# Altium project MicroMultimeter.PrjPCB
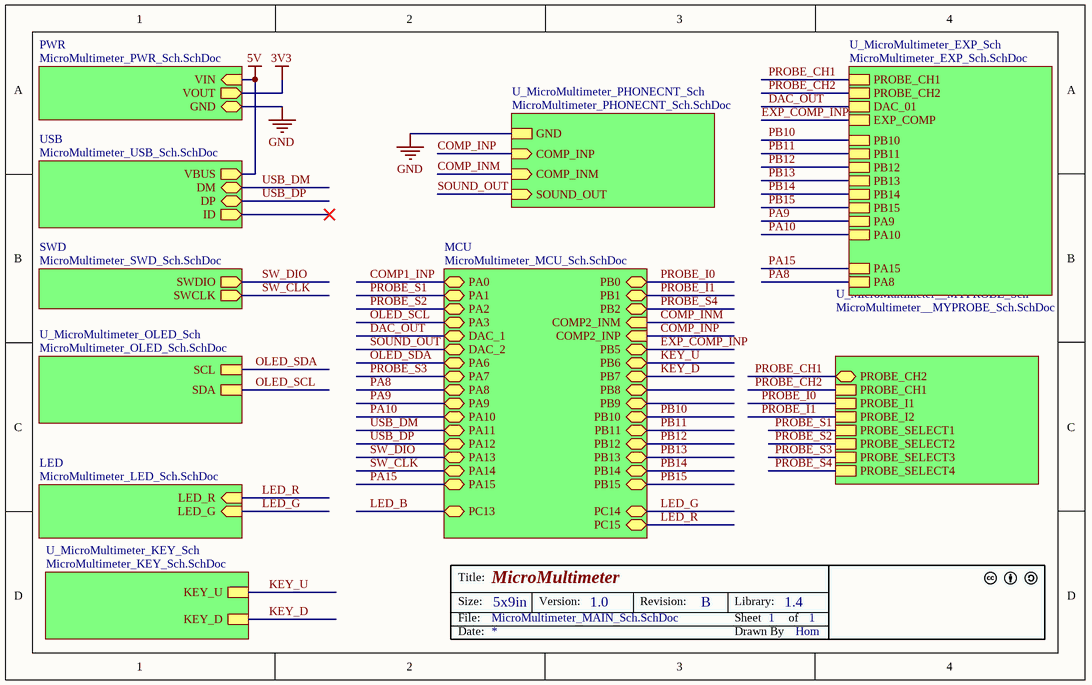
[diagram p0: MicroMultimeter_MAIN_Sch.SchDoc]
10 sheets, 52 parts. Net scope: hierarchical (ports join the sheet entries above them; power ports are global).
Board file: MicroMultimeter__Pcb.PcbDoc
Sheets:
  MicroMultimeter_MAIN_Sch.SchDoc
    PWR = MicroMultimeter_PWR_Sch.SchDoc
    SWD = MicroMultimeter_SWD_Sch.SchDoc
    USB = MicroMultimeter_USB_Sch.SchDoc
    LED = MicroMultimeter_LED_Sch.SchDoc
    MCU = MicroMultimeter_MCU_Sch.SchDoc
    U_MicroMultimeter_PHONECNT_Sch = MicroMultimeter_PHONECNT_Sch.SchDoc
    U_MicroMultimeter__MYPROBE_Sch = MicroMultimeter__MYPROBE_Sch.SchDoc
    U_MicroMultimeter_OLED_Sch = MicroMultimeter_OLED_Sch.SchDoc
    U_MicroMultimeter_EXP_Sch = MicroMultimeter_EXP_Sch.SchDoc

## Sheet MicroMultimeter_MAIN_Sch.SchDoc: MicroMultimeter
size 203 x 127 mm; Author: Hom; CompanyName: KitSprout; DrawnBy: Hom; Engineer: Hom; Organization: KitSprout; Revision: B; SheetNumber: 1; SheetTotal: 1; License: CC BY-SA 4.0; Version: 1.0; LibVersion: 1.4; PageSetup: Record=PageOptions|CenterHorizontal=True|CenterVertical=True|PrintScale=1.00|XCorrection=1.00|YCorrection=1.00|PrintKind=0|BorderSize=5000000|LeftOffset=0|BottomOffset=0|Orientation=2|PaperLength=1000|PaperWidth=1000|Scale=100|PaperSource=7|PrintQuality=-3|MediaType=1|DitherType=10|PrintScaleMode=0|PaperKind=A4|PaperIndex=9

### Sub-sheets
LED = MicroMultimeter_LED_Sch.SchDoc: LED_G (in), LED_R (in)
MCU = MicroMultimeter_MCU_Sch.SchDoc: PA0, PA1, PA2, PA3, DAC_1, DAC_2, PA6, PA7, PA8, PA9, PA10, PA11, PA12, PA13, PA14, PA15, PB0, PB1, COMP2_INM (in), COMP2_INP (in), PB2, PB5, PB6, PB7, PB8, PB9, PB10, PB11, PB12, PB13, PB14, PB15, PC13, PC14, PC15
PWR = MicroMultimeter_PWR_Sch.SchDoc: VOUT (out), VIN (in), GND (bidir)
SWD = MicroMultimeter_SWD_Sch.SchDoc: SWDIO (out), SWCLK (out)
U_MicroMultimeter__MYPROBE_Sch = MicroMultimeter__MYPROBE_Sch.SchDoc: PROBE_I1, PROBE_CH2 (bidir), PROBE_CH1, PROBE_I2, PROBE_SELECT1, PROBE_SELECT2, PROBE_SELECT3, PROBE_SELECT4
U_MicroMultimeter_EXP_Sch = MicroMultimeter_EXP_Sch.SchDoc: PROBE_CH1, PROBE_CH2, PB10, PB11, PB12, PB13, PB14, PB15, PA9, PA10, PA15, PA8, DAC_01, EXP_COMP
U_MicroMultimeter_KEY_Sch = MicroMultimeter_KEY_Sch.SchDoc (file not in this document): KEY_U, KEY_D
U_MicroMultimeter_OLED_Sch = MicroMultimeter_OLED_Sch.SchDoc: SCL, SDA
U_MicroMultimeter_PHONECNT_Sch = MicroMultimeter_PHONECNT_Sch.SchDoc: GND, SOUND_OUT (in), COMP_INP (in), COMP_INM (in)
USB = MicroMultimeter_USB_Sch.SchDoc: DM (bidir), VBUS (out), DP (bidir), ID (out)

### Nets
5V: sheet PWR/VIN, sheet USB/VBUS
GND: sheet PWR/GND, sheet U_MicroMultimeter_PHONECNT_Sch/GND
COMP_INM: sheet MCU/COMP2_INM, sheet U_MicroMultimeter_PHONECNT_Sch/COMP_INM
COMP_INP: sheet MCU/COMP2_INP, sheet U_MicroMultimeter_PHONECNT_Sch/COMP_INP
DAC_OUT: sheet MCU/DAC_1, sheet U_MicroMultimeter_EXP_Sch/DAC_01
EXP_COMP_INP: sheet MCU/PB5, sheet U_MicroMultimeter_EXP_Sch/EXP_COMP
KEY_D: sheet MCU/PB7, sheet U_MicroMultimeter_KEY_Sch/KEY_D
KEY_U: sheet MCU/PB6, sheet U_MicroMultimeter_KEY_Sch/KEY_U
LED_G: sheet LED/LED_G, sheet MCU/PC14
LED_R: sheet LED/LED_R, sheet MCU/PC15
OLED_SCL: sheet MCU/PA3, sheet U_MicroMultimeter_OLED_Sch/SDA
OLED_SDA: sheet MCU/PA6, sheet U_MicroMultimeter_OLED_Sch/SCL
PA8: sheet MCU/PA8, sheet U_MicroMultimeter_EXP_Sch/PA8
PA9: sheet MCU/PA9, sheet U_MicroMultimeter_EXP_Sch/PA9
PA10: sheet MCU/PA10, sheet U_MicroMultimeter_EXP_Sch/PA10
PA15: sheet MCU/PA15, sheet U_MicroMultimeter_EXP_Sch/PA15
PB10: sheet MCU/PB10, sheet U_MicroMultimeter_EXP_Sch/PB10
PB11: sheet MCU/PB11, sheet U_MicroMultimeter_EXP_Sch/PB11
PB12: sheet MCU/PB12, sheet U_MicroMultimeter_EXP_Sch/PB12
PB13: sheet MCU/PB13, sheet U_MicroMultimeter_EXP_Sch/PB13
PB14: sheet MCU/PB14, sheet U_MicroMultimeter_EXP_Sch/PB14
PB15: sheet MCU/PB15, sheet U_MicroMultimeter_EXP_Sch/PB15
PROBE_CH1: sheet U_MicroMultimeter__MYPROBE_Sch/PROBE_CH2, sheet U_MicroMultimeter_EXP_Sch/PROBE_CH1
PROBE_CH2: sheet MCU/PB1, sheet U_MicroMultimeter__MYPROBE_Sch/PROBE_CH1, sheet U_MicroMultimeter__MYPROBE_Sch/PROBE_I2, sheet U_MicroMultimeter_EXP_Sch/PROBE_CH2  [also labelled PROBE_I1]
PROBE_I0: sheet MCU/PB0, sheet U_MicroMultimeter__MYPROBE_Sch/PROBE_I1
PROBE_S1: sheet MCU/PA1, sheet U_MicroMultimeter__MYPROBE_Sch/PROBE_SELECT1
PROBE_S2: sheet MCU/PA2, sheet U_MicroMultimeter__MYPROBE_Sch/PROBE_SELECT2
PROBE_S3: sheet MCU/PA7, sheet U_MicroMultimeter__MYPROBE_Sch/PROBE_SELECT3
PROBE_S4: sheet MCU/PB2, sheet U_MicroMultimeter__MYPROBE_Sch/PROBE_SELECT4
SOUND_OUT: sheet MCU/DAC_2, sheet U_MicroMultimeter_PHONECNT_Sch/SOUND_OUT
SW_CLK: sheet SWD/SWCLK, sheet MCU/PA14
SW_DIO: sheet SWD/SWDIO, sheet MCU/PA13
USB_DM: sheet USB/DM, sheet MCU/PA11
USB_DP: sheet USB/DP, sheet MCU/PA12

### Notes on the sheet
- Title:
- Size:
- Date:
- File:
- 5x9in
- Version:
- Revision:
- Sheet
- Drawn By
- Library:
- of

## Sheet MicroMultimeter_PWR_Sch.SchDoc: MicroMultimeter - PWR
size 127 x 101 mm; Author: Hom; CompanyName: KitSprout; DrawnBy: Hom; Engineer: Hom; Organization: KitSprout; Revision: A; SheetNumber: 1; SheetTotal: 1; License: CC BY-SA 4.0; Version: 1.0; LibVersion: 1.4; PageSetup: Record=PageOptions|CenterHorizontal=True|CenterVertical=True|PrintScale=1.00|XCorrection=1.00|YCorrection=1.00|PrintKind=0|BorderSize=5000000|LeftOffset=0|BottomOffset=0|Orientation=2|PaperLength=1000|PaperWidth=1000|Scale=100|PaperSource=7|PrintQuality=-3|MediaType=1|DitherType=10|PrintScaleMode=0|PaperKind=A4|PaperIndex=9
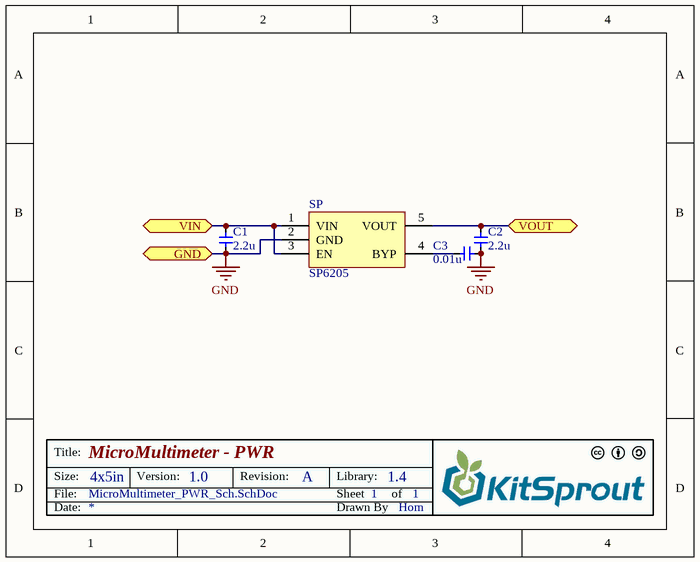
[diagram p1: MicroMultimeter_PWR_Sch.SchDoc]

### Parts
C1  value 2.2u  [CAP_0603]  (hidden comment: Cap_0603)
C2  value 2.2u  [CAP_0603]  (hidden comment: Cap_0603)
C3  value 0.01u  [CAP_0603]  (hidden comment: Cap_0603)
SP  SP6205  [SOT23-5]

### Ports
GND, VIN, VOUT

### Nets
3V3: C2.2 SP.5(VOUT) ; port VOUT
5V: C1.2 SP.1(VIN) SP.3(EN) ; port VIN
GND: C1.1 C2.1 C3.1 SP.2(GND) ; port GND
NetC3_2: C3.2 SP.4(BYP)

### Notes on the sheet
- Title:
- Size:
- Date:
- File:
- 4x5in
- Version:
- Revision:
- Sheet
- Drawn By
- Library:
- of

### Library data of the parts
C1-C3 = Cap_0603: Capacitor
SP = SP6205: Power

## Sheet MicroMultimeter_SWD_Sch.SchDoc: MicroMultimeter - SWD
size 127 x 101 mm; Author: Hom; CompanyName: KitSprout; DrawnBy: Hom; Engineer: Hom; Organization: KitSprout; Revision: A; SheetNumber: 1; SheetTotal: 1; License: CC BY-SA 4.0; Version: 1.0; LibVersion: 1.4; PageSetup: Record=PageOptions|CenterHorizontal=True|CenterVertical=True|PrintScale=1.00|XCorrection=1.00|YCorrection=1.00|PrintKind=0|BorderSize=5000000|LeftOffset=0|BottomOffset=0|Orientation=2|PaperLength=1000|PaperWidth=1000|Scale=100|PaperSource=7|PrintQuality=-3|MediaType=1|DitherType=10|PrintScaleMode=0|PaperKind=A4|PaperIndex=9
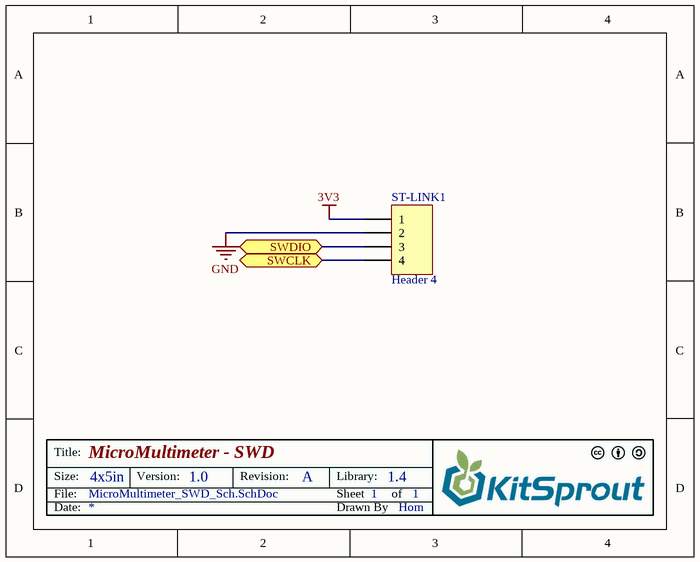
[diagram p2: MicroMultimeter_SWD_Sch.SchDoc]

### Parts
ST-LINK1  Header 4  [HDR1X4]

### Ports
SWCLK, SWDIO

### Nets
3V3: ST-LINK1.1
GND: ST-LINK1.2
SW_CLK: ST-LINK1.4 ; port SWCLK
SW_DIO: ST-LINK1.3 ; port SWDIO

### Notes on the sheet
- Title:
- Size:
- Date:
- File:
- 4x5in
- Version:
- Revision:
- Sheet
- Drawn By
- Library:
- of

### Library data of the parts
ST-LINK1 = Header 4: Header, 4-Pin; LatestRevisionDate: 17-Jul-2002; LatestRevisionNote: Re-released for DXP Platform.; Publisher: Altium Limited

## Sheet MicroMultimeter_USB_Sch.SchDoc: MicroMultimeter - USB
size 127 x 101 mm; Author: Hom; CompanyName: KitSprout; DrawnBy: Hom; Engineer: Hom; Organization: KitSprout; Revision: A; SheetNumber: 1; SheetTotal: 1; License: CC BY-SA 4.0; Version: 1.0; LibVersion: 1.4; PageSetup: Record=PageOptions|CenterHorizontal=True|CenterVertical=True|PrintScale=1.00|XCorrection=1.00|YCorrection=1.00|PrintKind=0|BorderSize=5000000|LeftOffset=0|BottomOffset=0|Orientation=2|PaperLength=1000|PaperWidth=1000|Scale=100|PaperSource=7|PrintQuality=-3|MediaType=1|DitherType=10|PrintScaleMode=0|PaperKind=A4|PaperIndex=9
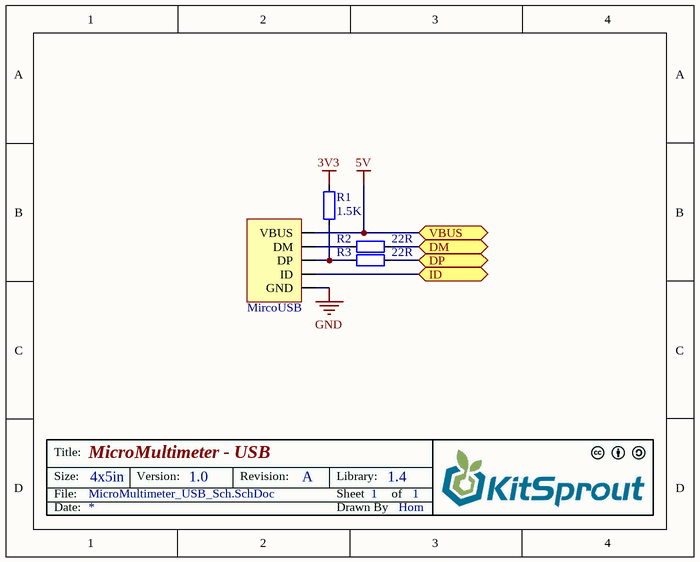
[diagram p3: MicroMultimeter_USB_Sch.SchDoc]

### Parts
MircoUSB  USB_Micro  [Micro_USB]  (value not drawn)
R1  value 1.5K  [RES_0603]  (hidden comment: Res_0603)
R2  value 22R  [RES_0603]  (hidden comment: Res_0603)
R3  value 22R  [RES_0603]  (hidden comment: Res_0603)

### Ports
DM, DP, ID, VBUS

### Nets
3V3: R1.1
5V: MircoUSB.1(VBUS) ; port VBUS
GND: MircoUSB.5(GND)
USB_DM: R2.2 ; port DM
USB_DP: R3.2 ; port DP
NetMircoUSB_2: MircoUSB.2(DM) R2.1
NetMircoUSB_3: MircoUSB.3(DP) R1.2 R3.1
NetMircoUSB_4: MircoUSB.4(ID) ; port ID

### Notes on the sheet
- Title:
- Size:
- Date:
- File:
- 4x5in
- Version:
- Revision:
- Sheet
- Drawn By
- Library:
- of

### Library data of the parts
MircoUSB = USB_Micro: USB
R1-R3 = Res_0603: Resistor

## Sheet MicroMultimeter_LED_Sch.SchDoc: MicroMultimeter - LED
size 127 x 101 mm; Author: Hom; CompanyName: KitSprout; DrawnBy: Hom; Engineer: Hom; Organization: KitSprout; Revision: A; SheetNumber: 1; SheetTotal: 1; License: CC BY-SA 4.0; Version: 1.0; LibVersion: 1.4; PageSetup: Record=PageOptions|CenterHorizontal=True|CenterVertical=True|PrintScale=1.00|XCorrection=1.00|YCorrection=1.00|PrintKind=0|BorderSize=5000000|LeftOffset=0|BottomOffset=0|Orientation=2|PaperLength=1000|PaperWidth=1000|Scale=100|PaperSource=7|PrintQuality=-3|MediaType=1|DitherType=10|PrintScaleMode=0|PaperKind=A4|PaperIndex=9
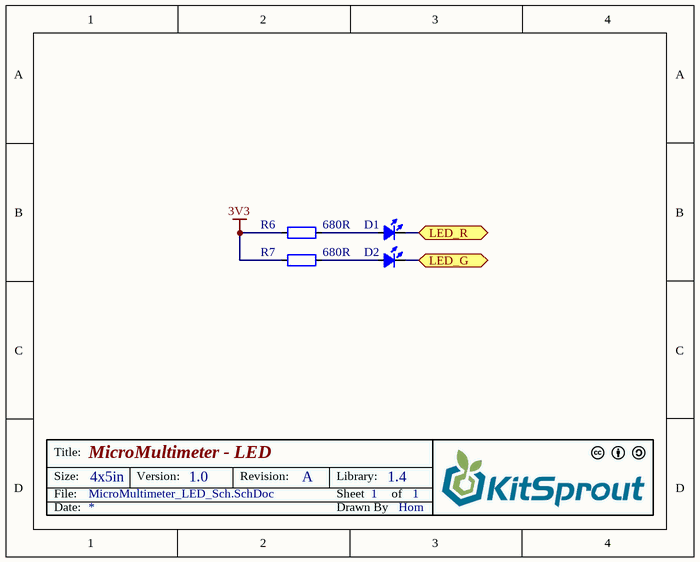
[diagram p4: MicroMultimeter_LED_Sch.SchDoc]

### Parts
D1  LED_0603  [LED_0603_RED]  (value not drawn)
D2  LED_0603  [LED_0603_GREEN]  (value not drawn)
R6  value 680R  [RES_0603]  (hidden comment: Res_0603)
R7  value 680R  [RES_0603]  (hidden comment: Res_0603)

### Ports
LED_G, LED_R

### Nets
3V3: R6.2 R7.2
LED_G: D2.2(K) ; port LED_G
LED_R: D1.2(K) ; port LED_R
NetD1_1: D1.1(A) R6.1
NetD2_1: D2.1(A) R7.1

### Notes on the sheet
- Title:
- Size:
- Date:
- File:
- 4x5in
- Version:
- Revision:
- Sheet
- Drawn By
- Library:
- of

### Library data of the parts
D1 D2 = LED_0603: LED
R6 R7 = Res_0603: Resistor

## Sheet MicroMultimeter_MCU_Sch.SchDoc: MicroMultimeter - MCU
size 203 x 203 mm; Author: Hom; CompanyName: KitSprout; DrawnBy: Hom; Engineer: Hom; Organization: KitSprout; Revision: A; SheetNumber: 1; SheetTotal: 1; License: CC BY-SA 4.0; Version: 1.0; LibVersion: 1.4; PageSetup: Record=PageOptions|CenterHorizontal=True|CenterVertical=True|PrintScale=1.00|XCorrection=1.00|YCorrection=1.00|PrintKind=0|BorderSize=5000000|LeftOffset=0|BottomOffset=0|Orientation=2|PaperLength=1000|PaperWidth=1000|Scale=100|PaperSource=7|PrintQuality=-3|MediaType=1|DitherType=10|PrintScaleMode=0|PaperKind=A4|PaperIndex=9
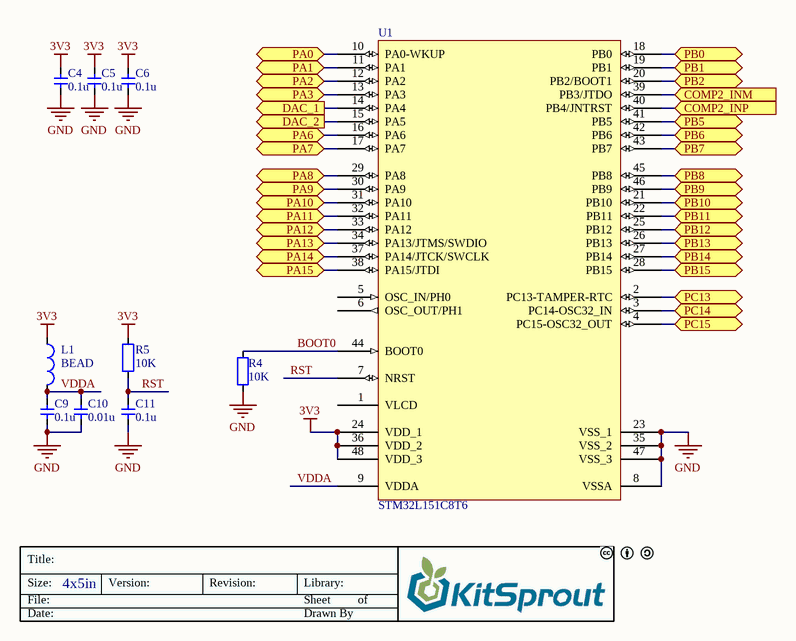
[diagram p5: MicroMultimeter_MCU_Sch.SchDoc]

### Parts
C4  value 0.1u  [CAP_0603]  (hidden comment: Cap_0603)
C5  value 0.1u  [CAP_0603]  (hidden comment: Cap_0603)
C6  value 0.1u  [CAP_0603]  (hidden comment: Cap_0603)
C9  value 0.1u  [CAP_0603]  (hidden comment: Cap_0603)
C10  value 0.01u  [CAP_0603]  (hidden comment: Cap_0603)
C11  value 0.1u  [CAP_0603]  (hidden comment: Cap_0603)
L1  value BEAD  [IND_0603]  (hidden comment: Ind_0603)
R4  value 10K  [RES_0603]  (hidden comment: Res_0603)
R5  value 10K  [RES_0603]  (hidden comment: Res_0603)
U1  STM32L151C8T6  [LQFP48_N]

### Ports
COMP2_INM (in), COMP2_INP (in), DAC_1 (out), DAC_2 (out), PA0, PA1, PA2, PA3, PA6, PA7, PA8, PA9, PA10, PA11, PA12, PA13, PA14, PA15, PB0, PB1, PB2, PB5, PB6, PB7, PB8, PB9, PB10, PB11, PB12, PB13, PB14, PB15, PC13, PC14, PC15

### Nets
3V3: C4.2 C5.2 C6.2 L1.1 R5.2 U1.24(VDD_1) U1.36(VDD_2) U1.48(VDD_3)
GND: C4.1 C5.1 C6.1 C9.1 C10.1 C11.1 R4.1 U1.8(VSSA) U1.23(VSS_1) U1.35(VSS_2) U1.47(VSS_3)
BOOT0: R4.2 U1.44(BOOT0)
COMP1_INP: U1.10(PA0-WKUP) ; port PA0
COMP_INM: U1.39(PB3/JTDO) ; port COMP2_INM
COMP_INP: U1.40(PB4/JNTRST) ; port COMP2_INP
DAC_OUT: U1.14(PA4) ; port DAC_1
EXP_COMP_INP: U1.41(PB5) ; port PB5
KEY_D: U1.43(PB7) ; port PB7
KEY_U: U1.42(PB6) ; port PB6
LED_B: U1.2(PC13-TAMPER-RTC) ; port PC13
LED_G: U1.3(PC14-OSC32_IN) ; port PC14
LED_R: U1.4(PC15-OSC32_OUT) ; port PC15
OLED_SCL: U1.13(PA3) ; port PA3
OLED_SDA: U1.16(PA6) ; port PA6
PA8: U1.29(PA8) ; port PA8
PA9: U1.30(PA9) ; port PA9
PA10: U1.31(PA10) ; port PA10
PA15: U1.38(PA15/JTDI) ; port PA15
PB10: U1.21(PB10) ; port PB10
PB11: U1.22(PB11) ; port PB11
PB12: U1.25(PB12) ; port PB12
PB13: U1.26(PB13) ; port PB13
PB14: U1.27(PB14) ; port PB14
PB15: U1.28(PB15) ; port PB15
PROBE_CH2: U1.19(PB1) ; port PB1
PROBE_I0: U1.18(PB0) ; port PB0
PROBE_S1: U1.11(PA1) ; port PA1
PROBE_S2: U1.12(PA2) ; port PA2
PROBE_S3: U1.17(PA7) ; port PA7
PROBE_S4: U1.20(PB2/BOOT1) ; port PB2
RST: C11.2 R5.1 U1.7(NRST)
SOUND_OUT: U1.15(PA5) ; port DAC_2
SW_CLK: U1.37(PA14/JTCK/SWCLK) ; port PA14
SW_DIO: U1.34(PA13/JTMS/SWDIO) ; port PA13
USB_DM: U1.32(PA11) ; port PA11
USB_DP: U1.33(PA12) ; port PA12
VDDA: C9.2 C10.2 L1.2 U1.9(VDDA)
NetU1_45: U1.45(PB8) ; port PB8
NetU1_46: U1.46(PB9) ; port PB9

Not connected (* = marked no-connect by the designer): U1 1(VLCD) 5(OSC_IN/PH0) 6(OSC_OUT/PH1)

### Notes on the sheet
- Title:
- Size:
- Date:
- File:
- 4x5in
- Version:
- Revision:
- Sheet
- Drawn By
- Library:
- of

### Library data of the parts
C4-C6 C9-C11 = Cap_0603: Capacitor
L1 = Ind_0603: Inductor
R4 R5 = Res_0603: Resistor
U1 = STM32L151C8T6: STM32 ARM-based 32-bit MCU with 64 Kbytes Flash, 48-pin LQFP, Industrial Temperature; Published: 30-May-2008; DatasheetVersion: rev6, Mar-2008; PackageVersion: Mar-2008; PackageReference: LQFP48; Publisher: Altium Limited; PackageDescription: 48-Pin Low-Profile Quad Flat Pack, 7 x 7 mm Body, 0.5 mm Pitch (LQFP48); ComponentLink1Description: Manufacturer Link; ComponentLink1URL: www.st.com/stm32; ComponentLink2Description: Datasheet; ComponentLink2URL: http://www.st.com/stonline/products/literature/ds/13586.pdf

## Sheet MicroMultimeter_PHONECNT_Sch.SchDoc
size A4
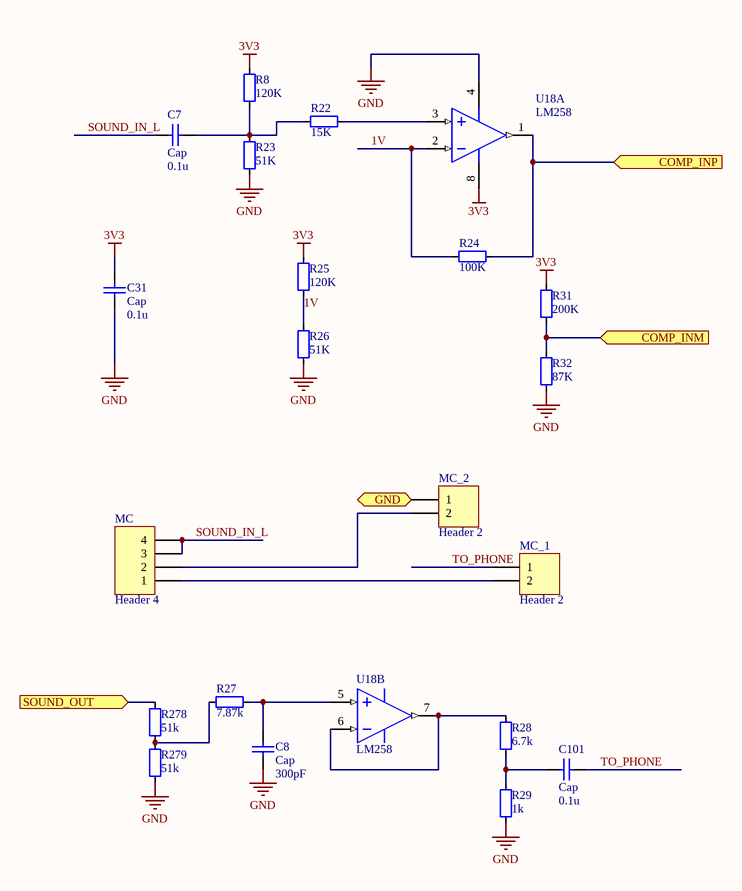
[diagram p6: MicroMultimeter_PHONECNT_Sch.SchDoc]

### Parts
C7  Cap  value 0.1u  [CAP_0603]
C8  Cap  value 300pF  [CAP_0603]
C31  Cap  value 0.1u  [CAP_0603]
C101  Cap  value 0.1u  [CAP_0603]
MC  Header 4  [MIRCOPHONE_2]
MC_1  Header 2  [HDR1X2]
MC_2  Header 2  [HDR1X2]
R8  value 120K  [RES_0603]  (hidden comment: Res_0603)
R22  value 15K  [RES_0603]  (hidden comment: Res_0603)
R23  value 51K  [RES_0603]  (hidden comment: Res_0603)
R24  value 100K  [RES_0603]  (hidden comment: Res_0603)
R25  value 120K  [RES_0603]  (hidden comment: Res_0603)
R26  value 51K  [RES_0603]  (hidden comment: Res_0603)
R27  value 7.87k  [RES_0603]  (hidden comment: Res_0603)
R28  value 6.7k  [RES_0603]  (hidden comment: Res_0603)
R29  value 1k  [RES_0603]  (hidden comment: Res_0603)
R31  value 200K  [RES_0603]  (hidden comment: Res_0603)
R32  value 87K  [RES_0603]  (hidden comment: Res_0603)
R278  value 51k  [RES_0603]  (hidden comment: Res_0603)
R279  value 51k  [RES_0603]  (hidden comment: Res_0603)
U18  LM258  [SOP-8]  (parts A,B of 2)

### Ports
COMP_INM (in), COMP_INP (in), GND, SOUND_OUT (in)

### Nets
3V3: C31.2 R8.2 R25.2 R31.2 U18.8(V+)
GND: C8.1 C31.1 MC_2.1 R23.1 R26.1 R29.2 R32.1 R279.2 U18.4(V-) ; port GND
1V: R24.2 R25.1 R26.2 U18.2(IN-)
COMP_INM: R31.1 R32.2 ; port COMP_INM
COMP_INP: R24.1 U18.1(OUT) ; port COMP_INP
SOUND_IN_L: C7.1 MC.3 MC.4
SOUND_OUT: R278.1 ; port SOUND_OUT
TO_PHONE: C101.2 MC_1.1
NetC7_2: C7.2 R8.1 R22.2 R23.2
NetC8_2: C8.2 R27.1 U18.5(IN+)
NetC101_1: C101.1 R28.2 R29.1
NetMC_1: MC.1 MC_1.2
NetMC_2: MC.2 MC_2.2
NetR22_1: R22.1 U18.3(IN+)
NetR27_2: R27.2 R278.2 R279.1
NetR28_1: R28.1 U18.6(IN-) U18.7(OUT)

### Library data of the parts
C7 C8 C31 C101 = Cap: Capacitor; Published: 8-Jun-2000; LatestRevisionDate: 17-Jul-2002; LatestRevisionNote: Re-released for DXP Platform.; PackageReference: RAD-0.3; Publisher: Altium Limited; PackageDescription: Radial Cap, Thru-Hole; 2 Leads; 0.3 in Pin Spacing
MC = Header 4: Header, 4-Pin; LatestRevisionDate: 17-Jul-2002; LatestRevisionNote: Re-released for DXP Platform.; Publisher: Altium Limited
MC_1 MC_2 = Header 2: Header, 2-Pin; LatestRevisionDate: 17-Jul-2002; LatestRevisionNote: Re-released for DXP Platform.; Publisher: Altium Limited
R8 R22-R29 R31 R32 R278 R279 = Res_0603: Resistor
U18 = LM258: Amplifier; Text Field7: Published 8-Jun-2000

## Sheet MicroMultimeter__MYPROBE_Sch.SchDoc: MicroMultimeter - Probe
size 152 x 101 mm; Author: Hom; CompanyName: KitSprout; DrawnBy: Hom; Engineer: Hom; Organization: KitSprout; Revision: A; SheetNumber: 1; SheetTotal: 1; License: CC BY-SA 4.0; Version: 1.0; LibVersion: 1.4; PageSetup: Record=PageOptions|CenterHorizontal=True|CenterVertical=True|PrintScale=1.00|XCorrection=1.00|YCorrection=1.00|PrintKind=0|BorderSize=5000000|LeftOffset=0|BottomOffset=0|Orientation=2|PaperLength=1000|PaperWidth=1000|Scale=100|PaperSource=7|PrintQuality=-3|MediaType=1|DitherType=10|PrintScaleMode=0|PaperKind=A4|PaperIndex=9
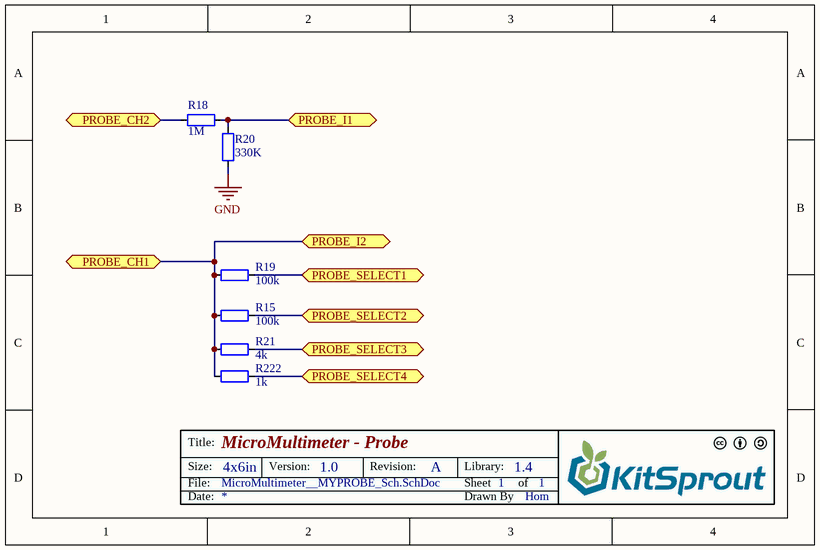
[diagram p7: MicroMultimeter__MYPROBE_Sch.SchDoc]

### Parts
R15  value 100k  [RES_0603]  (hidden comment: Res_0603)
R18  value 1M  [RES_0603]  (hidden comment: Res_0603)
R19  value 100k  [RES_0603]  (hidden comment: Res_0603)
R20  value 330K  [RES_0603]  (hidden comment: Res_0603)
R21  value 4k  [RES_0603]  (hidden comment: Res_0603)
R222  value 1k  [RES_0603]  (hidden comment: Res_0603)

### Ports
PROBE_CH1, PROBE_CH2 (bidir), PROBE_I1, PROBE_I2, PROBE_SELECT1, PROBE_SELECT2, PROBE_SELECT3, PROBE_SELECT4

### Nets
GND: R20.1
PROBE_CH1: R18.2 ; port PROBE_CH2
PROBE_CH2: R15.2 R19.2 R21.2 R222.2 ; port PROBE_CH1, port PROBE_I2
PROBE_I0: R18.1 R20.2 ; port PROBE_I1
PROBE_S1: R19.1 ; port PROBE_SELECT1
PROBE_S2: R15.1 ; port PROBE_SELECT2
PROBE_S3: R21.1 ; port PROBE_SELECT3
PROBE_S4: R222.1 ; port PROBE_SELECT4

### Notes on the sheet
- Title:
- Size:
- Date:
- File:
- 4x6in
- Version:
- Revision:
- Sheet
- Drawn By
- Library:
- of

### Library data of the parts
R15 R18-R21 R222 = Res_0603: Resistor

## Sheet MicroMultimeter_OLED_Sch.SchDoc: MicroMultimeter - OLED
size 127 x 101 mm; Author: Hom; CompanyName: KitSprout; DrawnBy: Hom; Engineer: Hom; Organization: KitSprout; Revision: A; SheetNumber: 1; SheetTotal: 1; License: CC BY-SA 4.0; Version: 1.0; LibVersion: 1.4; PageSetup: Record=PageOptions|CenterHorizontal=True|CenterVertical=True|PrintScale=1.00|XCorrection=1.00|YCorrection=1.00|PrintKind=0|BorderSize=5000000|LeftOffset=0|BottomOffset=0|Orientation=2|PaperLength=1000|PaperWidth=1000|Scale=100|PaperSource=7|PrintQuality=-3|MediaType=1|DitherType=10|PrintScaleMode=0|PaperKind=A4|PaperIndex=9
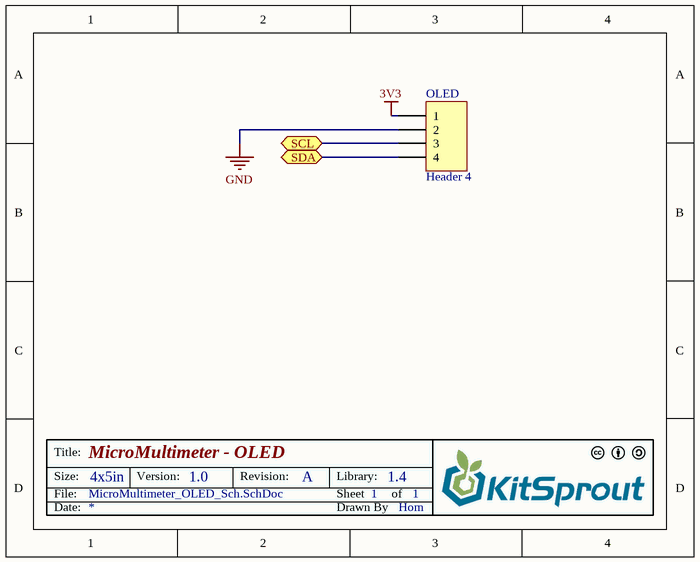
[diagram p8: MicroMultimeter_OLED_Sch.SchDoc]

### Parts
OLED  Header 4  [HDR1X4]

### Ports
SCL, SDA

### Nets
3V3: OLED.1
GND: OLED.2
OLED_SCL: OLED.4 ; port SDA
OLED_SDA: OLED.3 ; port SCL

### Notes on the sheet
- Title:
- Size:
- Date:
- File:
- 4x5in
- Version:
- Revision:
- Sheet
- Drawn By
- Library:
- of

### Library data of the parts
OLED = Header 4: Header, 4-Pin; LatestRevisionDate: 17-Jul-2002; LatestRevisionNote: Re-released for DXP Platform.; Publisher: Altium Limited

## Sheet MicroMultimeter_EXP_Sch.SchDoc: MicroMultimeter - EXP
size 127 x 101 mm; Author: Hom; CompanyName: KitSprout; DrawnBy: Hom; Engineer: Hom; Organization: KitSprout; Revision: A; SheetNumber: 1; SheetTotal: 1; License: CC BY-SA 4.0; Version: 1.0; LibVersion: 1.4; PageSetup: Record=PageOptions|CenterHorizontal=True|CenterVertical=True|PrintScale=1.00|XCorrection=1.00|YCorrection=1.00|PrintKind=0|BorderSize=5000000|LeftOffset=0|BottomOffset=0|Orientation=2|PaperLength=1000|PaperWidth=1000|Scale=100|PaperSource=7|PrintQuality=-3|MediaType=1|DitherType=10|PrintScaleMode=0|PaperKind=A4|PaperIndex=9
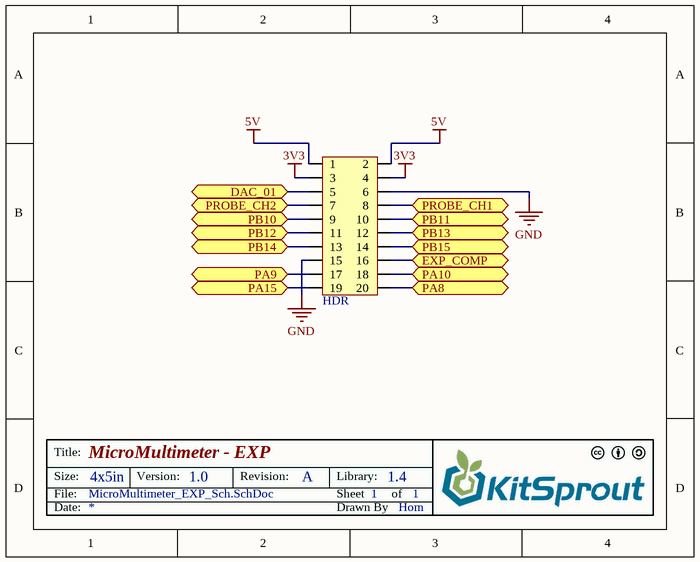
[diagram p9: MicroMultimeter_EXP_Sch.SchDoc]

### Parts
HDR  HDR2x10_2.54  [HDR2X10_2.54_180HF]  (value not drawn)

### Ports
DAC_01, EXP_COMP, PA8, PA9, PA10, PA15, PB10, PB11, PB12, PB13, PB14, PB15, PROBE_CH1, PROBE_CH2

### Nets
3V3: HDR.3 HDR.4
5V: HDR.1 HDR.2
GND: HDR.6 HDR.15
DAC_OUT: HDR.5 ; port DAC_01
EXP_COMP_INP: HDR.16 ; port EXP_COMP
PA8: HDR.20 ; port PA8
PA9: HDR.17 ; port PA9
PA10: HDR.18 ; port PA10
PA15: HDR.19 ; port PA15
PB10: HDR.9 ; port PB10
PB11: HDR.10 ; port PB11
PB12: HDR.11 ; port PB12
PB13: HDR.12 ; port PB13
PB14: HDR.13 ; port PB14
PB15: HDR.14 ; port PB15
PROBE_CH1: HDR.8 ; port PROBE_CH1
PROBE_CH2: HDR.7 ; port PROBE_CH2

### Notes on the sheet
- Title:
- Size:
- Date:
- File:
- 4x5in
- Version:
- Revision:
- Sheet
- Drawn By
- Library:
- of

### Library data of the parts
HDR = HDR2x10_2.54: Header

## Nets that join several sheets
3V3: MicroMultimeter_PWR_Sch (C2.2 SP.5), MicroMultimeter_SWD_Sch (ST-LINK1.1), MicroMultimeter_USB_Sch (R1.1), MicroMultimeter_LED_Sch (R6.2 R7.2), MicroMultimeter_MCU_Sch (8 pins), MicroMultimeter_PHONECNT_Sch (5 pins), MicroMultimeter_OLED_Sch (OLED.1), MicroMultimeter_EXP_Sch (HDR.3 HDR.4)
5V: MicroMultimeter_PWR_Sch (C1.2 SP.1 SP.3), MicroMultimeter_USB_Sch (MircoUSB.1), MicroMultimeter_EXP_Sch (HDR.1 HDR.2)
GND: MicroMultimeter_PWR_Sch (C1.1 C2.1 C3.1 SP.2), MicroMultimeter_SWD_Sch (ST-LINK1.2), MicroMultimeter_USB_Sch (MircoUSB.5), MicroMultimeter_MCU_Sch (11 pins), MicroMultimeter_PHONECNT_Sch (9 pins), MicroMultimeter__MYPROBE_Sch (R20.1), MicroMultimeter_OLED_Sch (OLED.2), MicroMultimeter_EXP_Sch (HDR.6 HDR.15)
COMP_INM: MicroMultimeter_MCU_Sch (U1.39), MicroMultimeter_PHONECNT_Sch (R31.1 R32.2)
COMP_INP: MicroMultimeter_MCU_Sch (U1.40), MicroMultimeter_PHONECNT_Sch (R24.1 U18.1)
DAC_OUT: MicroMultimeter_MCU_Sch (U1.14), MicroMultimeter_EXP_Sch (HDR.5)
EXP_COMP_INP: MicroMultimeter_MCU_Sch (U1.41), MicroMultimeter_EXP_Sch (HDR.16)
LED_G: MicroMultimeter_LED_Sch (D2.2), MicroMultimeter_MCU_Sch (U1.3)
LED_R: MicroMultimeter_LED_Sch (D1.2), MicroMultimeter_MCU_Sch (U1.4)
OLED_SCL: MicroMultimeter_MCU_Sch (U1.13), MicroMultimeter_OLED_Sch (OLED.4)
OLED_SDA: MicroMultimeter_MCU_Sch (U1.16), MicroMultimeter_OLED_Sch (OLED.3)
PA8: MicroMultimeter_MCU_Sch (U1.29), MicroMultimeter_EXP_Sch (HDR.20)
PA9: MicroMultimeter_MCU_Sch (U1.30), MicroMultimeter_EXP_Sch (HDR.17)
PA10: MicroMultimeter_MCU_Sch (U1.31), MicroMultimeter_EXP_Sch (HDR.18)
PA15: MicroMultimeter_MCU_Sch (U1.38), MicroMultimeter_EXP_Sch (HDR.19)
PB10: MicroMultimeter_MCU_Sch (U1.21), MicroMultimeter_EXP_Sch (HDR.9)
PB11: MicroMultimeter_MCU_Sch (U1.22), MicroMultimeter_EXP_Sch (HDR.10)
PB12: MicroMultimeter_MCU_Sch (U1.25), MicroMultimeter_EXP_Sch (HDR.11)
PB13: MicroMultimeter_MCU_Sch (U1.26), MicroMultimeter_EXP_Sch (HDR.12)
PB14: MicroMultimeter_MCU_Sch (U1.27), MicroMultimeter_EXP_Sch (HDR.13)
PB15: MicroMultimeter_MCU_Sch (U1.28), MicroMultimeter_EXP_Sch (HDR.14)
PROBE_CH1: MicroMultimeter__MYPROBE_Sch (R18.2), MicroMultimeter_EXP_Sch (HDR.8)
PROBE_CH2: MicroMultimeter_MCU_Sch (U1.19), MicroMultimeter__MYPROBE_Sch (R15.2 R19.2 R21.2 R222.2), MicroMultimeter_EXP_Sch (HDR.7)
PROBE_I0: MicroMultimeter_MCU_Sch (U1.18), MicroMultimeter__MYPROBE_Sch (R18.1 R20.2)
PROBE_S1: MicroMultimeter_MCU_Sch (U1.11), MicroMultimeter__MYPROBE_Sch (R19.1)
PROBE_S2: MicroMultimeter_MCU_Sch (U1.12), MicroMultimeter__MYPROBE_Sch (R15.1)
PROBE_S3: MicroMultimeter_MCU_Sch (U1.17), MicroMultimeter__MYPROBE_Sch (R21.1)
PROBE_S4: MicroMultimeter_MCU_Sch (U1.20), MicroMultimeter__MYPROBE_Sch (R222.1)
SOUND_OUT: MicroMultimeter_MCU_Sch (U1.15), MicroMultimeter_PHONECNT_Sch (R278.1)
SW_CLK: MicroMultimeter_SWD_Sch (ST-LINK1.4), MicroMultimeter_MCU_Sch (U1.37)
SW_DIO: MicroMultimeter_SWD_Sch (ST-LINK1.3), MicroMultimeter_MCU_Sch (U1.34)
USB_DM: MicroMultimeter_USB_Sch (R2.2), MicroMultimeter_MCU_Sch (U1.32)
USB_DP: MicroMultimeter_USB_Sch (R3.2), MicroMultimeter_MCU_Sch (U1.33)